# Altium project UU004_UUDMA.PrjPcb
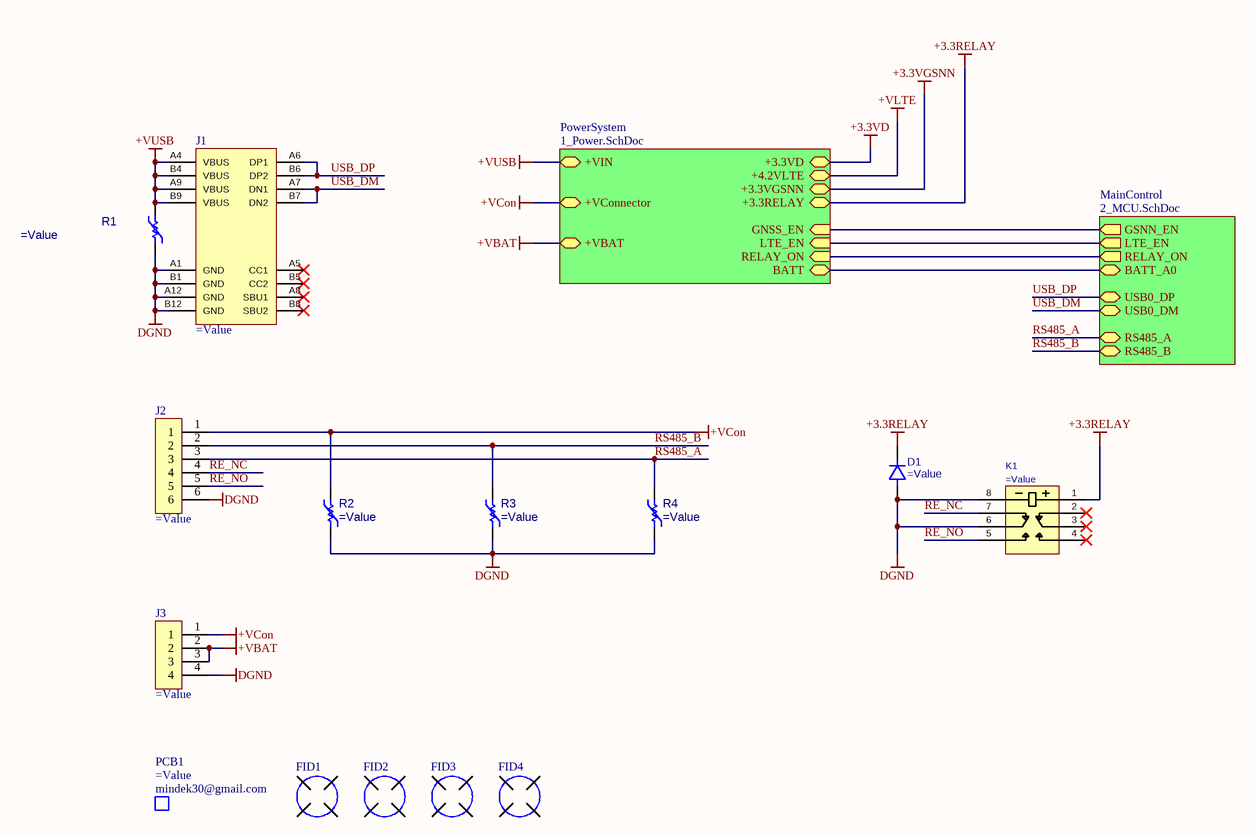
[diagram p0: 0_Overview.SchDoc]
PCB_Name: UUDMA; PCB_PN: UU004; PCB_Rev: A; PCBA_PN: UU004; PCBA_Rev: A
3 sheets, 121 parts. Net scope: hierarchical (ports join the sheet entries above them; power ports are global).
Board file: UU004_UUDMA.PcbDoc
Sheets:
  0_Overview.SchDoc
    MainControl = 2_MCU.SchDoc
    PowerSystem = 1_Power.SchDoc

## Sheet 0_Overview.SchDoc: Overview
size A3; DocumentNumber: 1; SheetNumber: 1; SheetTotal: 6; PageSetup: Record=PageOptions|CenterHorizontal=True|CenterVertical=True|PrintScale=1.01|XCorrection=1.00|YCorrection=1.00|PrintKind=0|BorderSize=5000000|LeftOffset=0|BottomOffset=0|Orientation=2|PaperLength=1000|PaperWidth=1000|Scale=100|PaperSource=7|PrintQuality=-4|MediaType=1|DitherType=10|PaperKind=A3|PrintScaleMode=1

### Parts
D1  (no value)  [SOD323]
FID1  FIDUCIAL  [FID]  (value not drawn)  (no BOM)
FID2  FIDUCIAL  [FID]  (value not drawn)  (no BOM)
FID3  FIDUCIAL  [FID]  (value not drawn)  (no BOM)
FID4  FIDUCIAL  [FID]  (value not drawn)  (no BOM)
J1  (no value)  [GCT_USB4085-GF-A_REVA4]
J2  (no value)  [CON_6P_Header]  (no BOM)
J3  (no value)  [CON_4P_Header]  (no BOM)
K1  (no value)  [RELAY_HFD4/12-SR]
PCB1  Manufacturer: mindek30@gmail.com  (mechanical)
R1  (no value)  [R_0603]
R2  (no value)  [R_0603]
R3  (no value)  [R_0603]
R4  (no value)  [R_0603]

### Sub-sheets
MainControl = 2_MCU.SchDoc: BATT_A0 (bidir), RS485_A (bidir), RS485_B (bidir), USB0_DP (bidir), USB0_DM (bidir), GSNN_EN (out), LTE_EN (out), RELAY_ON (out)
PowerSystem = 1_Power.SchDoc: BATT (bidir), +VIN (bidir), +3.3VD (bidir), GNSS_EN (in), LTE_EN (in), +VConnector (bidir), +4.2VLTE (bidir), +3.3VGSNN (bidir), +3.3RELAY (bidir), RELAY_ON (in), +VBAT (bidir)

### Nets
+3.3RELAY: D1.1 K1.1 ; sheet PowerSystem/+3.3RELAY
+VBAT: J3.2 J3.3 ; sheet PowerSystem/+VBAT
+VCon: J2.1 J3.1 R2.1 ; sheet PowerSystem/+VConnector
+VUSB: J1.A4(VBUS) J1.A9(VBUS) J1.B4(VBUS) J1.B9(VBUS) R1.2 ; sheet PowerSystem/+VIN
DGND: D1.2 J1.A1(GND) J1.A12(GND) J1.B1(GND) J1.B12(GND) J2.6 J3.4 K1.6 K1.8 R1.1 R2.2 R3.1 R4.2
ADC1_IN12: sheet MainControl/BATT_A0, sheet PowerSystem/BATT
LTE_GPSEN: sheet MainControl/GSNN_EN, sheet PowerSystem/GNSS_EN
LTE_PowerON: sheet MainControl/LTE_EN, sheet PowerSystem/LTE_EN
RE_NC: J2.4 K1.7
RE_NO: J2.5 K1.5
RELAY_ON: sheet MainControl/RELAY_ON, sheet PowerSystem/RELAY_ON
RS485_A: J2.3 R4.1 ; sheet MainControl/RS485_A
RS485_B: J2.2 R3.2 ; sheet MainControl/RS485_B
USB_DM: J1.A7(DN1) J1.B7(DN2) ; sheet MainControl/USB0_DM
USB_DP: J1.A6(DP1) J1.B6(DP2) ; sheet MainControl/USB0_DP

Not connected (* = marked no-connect by the designer): J1 A5(CC1)* A8(SBU1)* B5(CC2)* B8(SBU2)*; K1 2* 3* 4*

### Notes on the sheet
- Title :
- Revision :
- ผู้จัดทำ:
- Size:
- A3
- Time:
- ผู้เขียน:
- บริษัท ยูนิเวอร์แซล ยูทีลิตี้ส์ จำกัด (มหาชน) เลขที่ 1 อาคาร อีสท์วอเตอร์ ชั้น 18 ซอยวิภาวดีรังสิต 5 แขวงจอมพล เขตจตุจักร กรุงเทพฯ 10900
  Tel : +662-272-1688
  Fax :+662-2721690-1
- -
- Sheet:
- of
- ผู้อำนวยการ
- ผู้ตรวจสอบ:
- Number:
- กรรมการผู้จัดการ:
- File:

### Library data of the parts
D1 = D_PW_SD103AWS: DIODE SCHOTTKY 40V 2A 0603; Manufacturer: Slkor(SLKORMICRO Elec.); Value: SD103AWS; PackageReference: SOD-323; PartID: C513472; PartNumber: SD103AWS
FID1-FID4 = FID_FIDUCIAL: Manufacturer: mindek30@gmail.com; PartNumber: UU004_A; Value2: Non SE; Value: Non SE; PartID: A; PackageReference: Non SE; Value3: Non SE
J1 = CON_USBC_USB4085: CONN RCPT USB2.0 TYPE C 16+8POS; PartNumber: USB4085-GF-A; Manufacturer: GCT; Value: USB4085-GF-A; PartID: 2073-USB4085-GF-ACT-ND; PackageReference: *; Value2: *; Value3: *
J2 = CON_6P_Heder: Connector 6 position; PartNumber: *; PartID: *; Manufacturer: *; PackageReference: *; Value: *; Value2: *; Value3: *
J3 = CON_4P_Heder: Connector 4 position; PartNumber: *; PartID: *; Manufacturer: *; PackageReference: *; Value: *; Value2: *; Value3: *
K1 = SW_RELAY_HFD4/12-SR: Telecom Non Latching 3VDC DPDT SMD Relays RoHS; Manufacturer: Xiamen Hongfa Electroacoustic; Value: HFD4/3-S1R; PackageReference: *; PartID: C143232; PartNumber: HFD4/3-S1R
PCB1 = PCB_Bare: BARE PCB; PartNumber: UU004_A; PackageReference: Non SE; PartID: A; Value2: =JobFile_Title; Value: =PartNumber; Value3: UU004_A
R1-R4 = R_VAR_VCAC060326C820MRP: VARISTOR 36V 30A 0603; Manufacturer: KYOCERA AVX; Value: VCAC060326C820MRP; PackageReference: 0603; PartID: 478-6255-1-ND; PartNumber: VCAC060326C820MRP

## Sheet 2_MCU.SchDoc
size A3; DocumentNumber: 3; SheetNumber: 3; SheetTotal: 6; PageSetup: Record=PageOptions|CenterHorizontal=True|CenterVertical=True|PrintScale=1.01|XCorrection=1.00|YCorrection=1.00|PrintKind=0|BorderSize=5000000|LeftOffset=0|BottomOffset=0|Orientation=2|PaperLength=1000|PaperWidth=1000|Scale=100|PaperSource=7|PrintQuality=-4|MediaType=1|DitherType=10|PaperKind=A3|PrintScaleMode=1
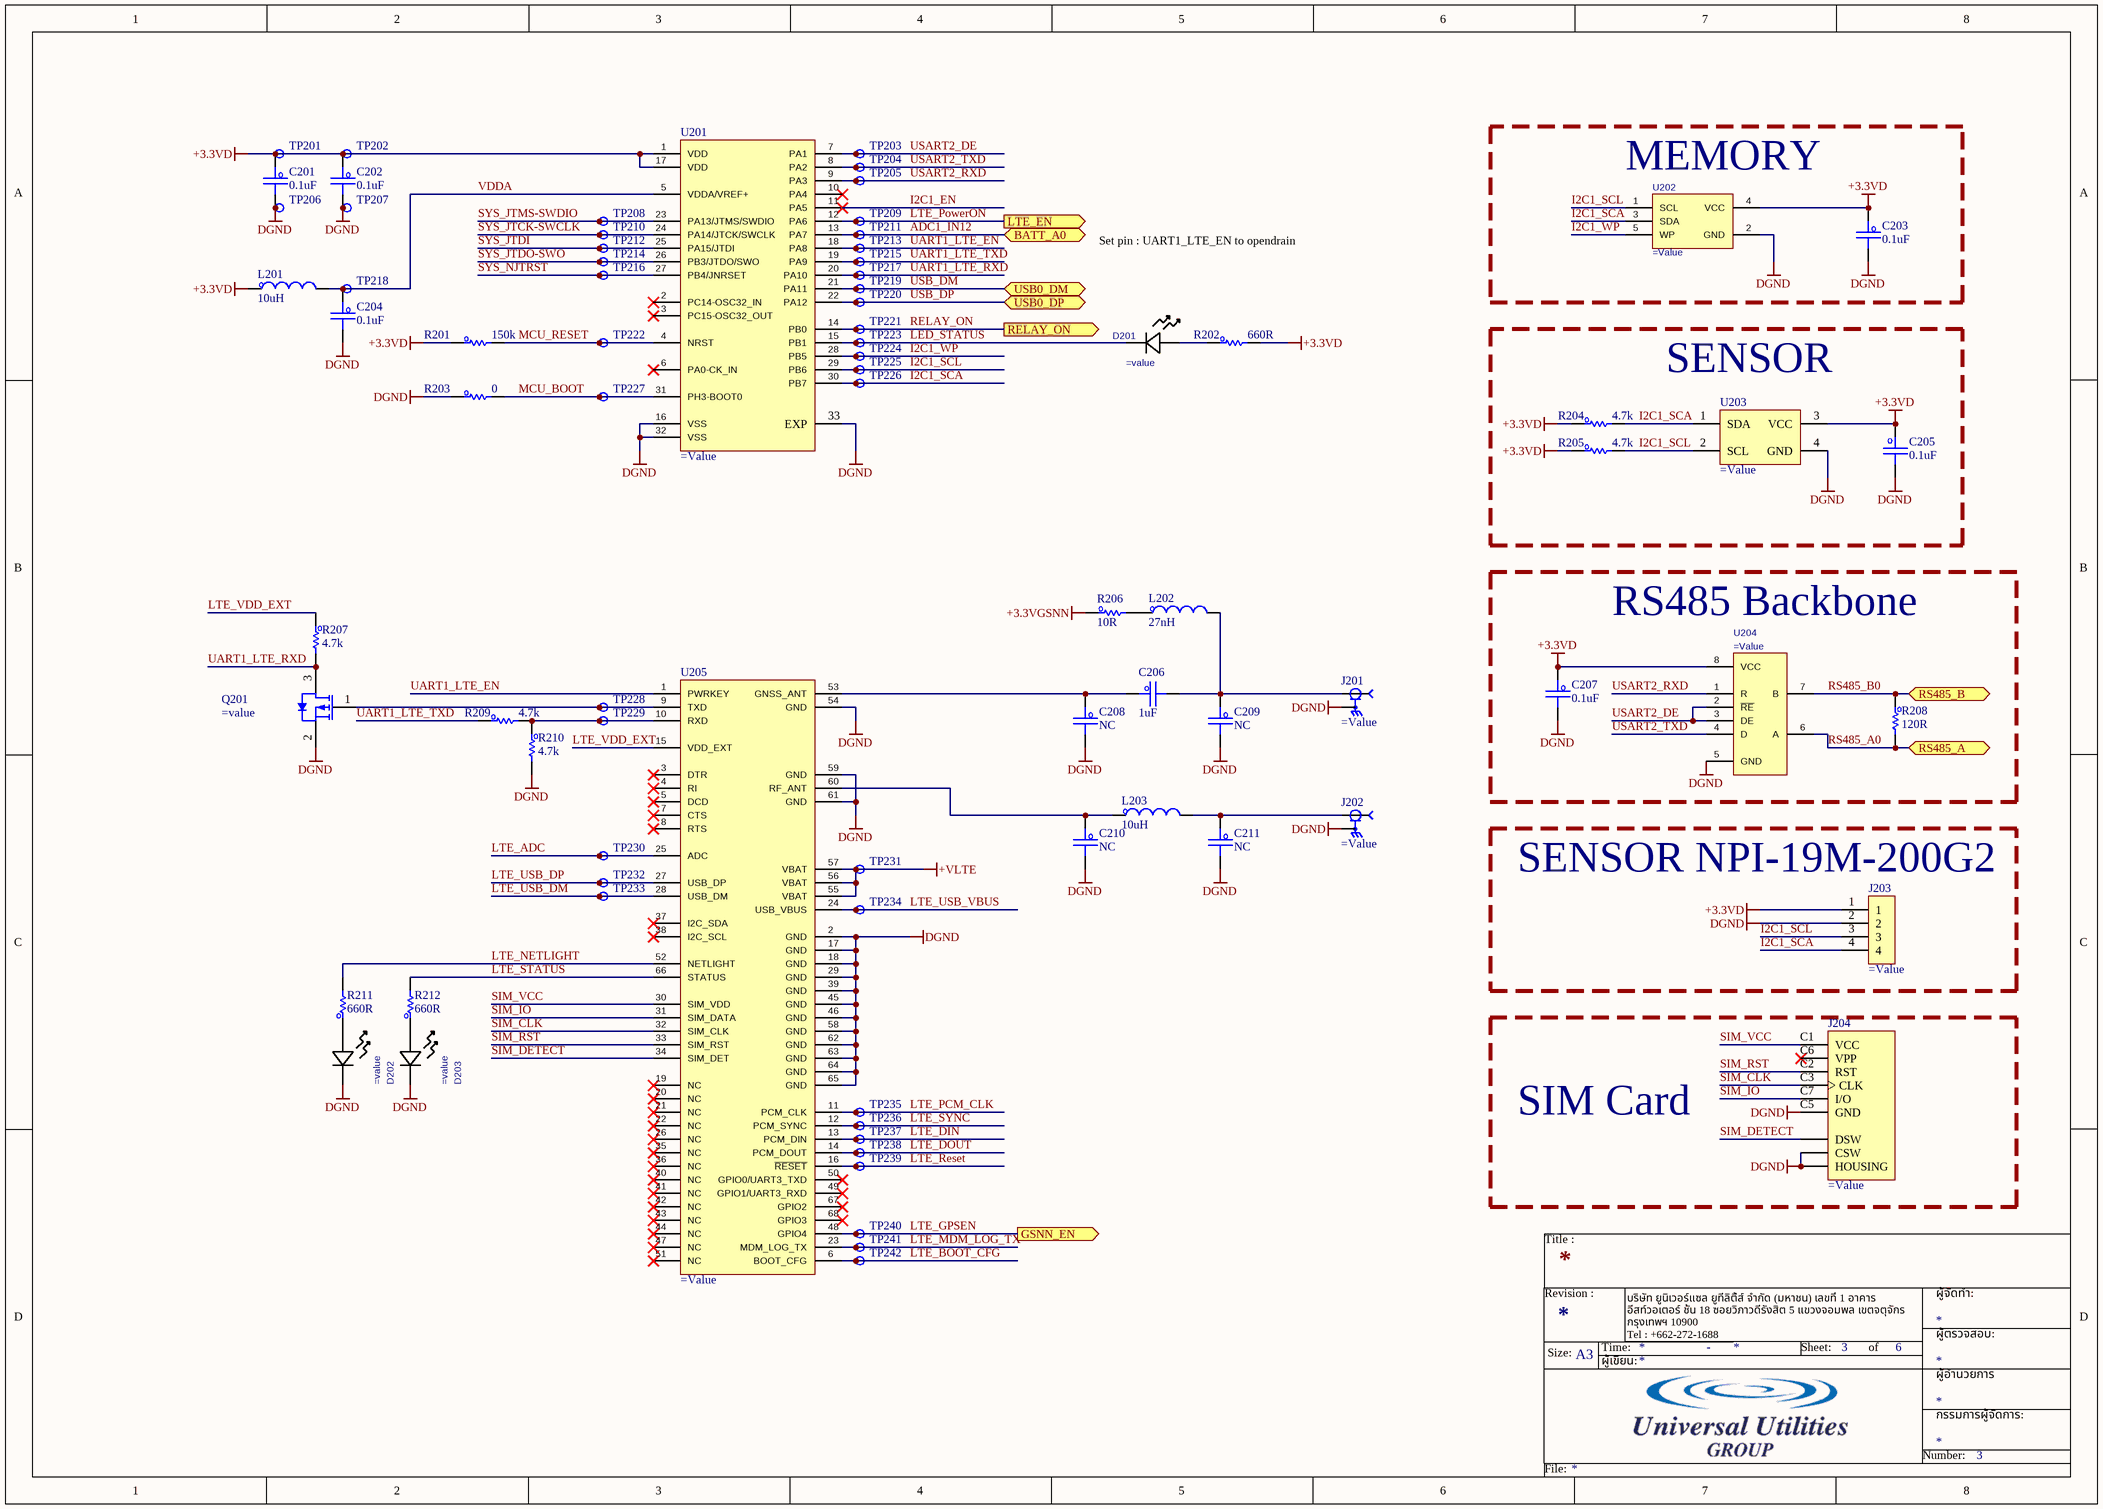
[diagram p1: 2_MCU.SchDoc]

### Parts
C201  0.1uF  [C_0603]
C202  0.1uF  [C_0603]
C203  0.1uF  [C_0603]
C204  0.1uF  [C_0603]
C205  0.1uF  [C_0603]
C206  1uF  [C_0603]
C207  0.1uF  [C_0603]
C208  NC  [C_0603]  (no BOM)
C209  NC  [C_0603]  (no BOM)
C210  NC  [C_0603]  (no BOM)
C211  NC  [C_0603]  (no BOM)
D201  (no value)  [LED_0VS75000_WRE]
D202  (no value)  [LED_0VS75000_WRE]
D203  (no value)  [LED_0VS75000_WRE]
J201  (no value)  [MOLEX_0734120114]
J202  (no value)  [MOLEX_0734120114]
J203  (no value)  [CON_4P_PADSENSOR]  (no BOM)
J204  (no value)  [JAE_SF72S006VBDR2500]
L201  10uH  [L_0603]
L202  27nH  [L_0603]
L203  10uH  [L_0603]
Q201  (no value)  [SOT95P245X110-3M]
R201  150k  [R_0603]
R202  660R  [R_0603]
R203  0  [R_0603]
R204  4.7k  [R_0603]
R205  4.7k  [R_0603]
R206  10R  [R_0603]
R207  4.7k  [R_0603]
R208  120R  [R_0603]
R209  4.7k  [R_0603]
R210  4.7k  [R_0603]
R211  660R  [R_0603]
R212  660R  [R_0603]
TP201  (no value)  [TP_Testpoint]  (no BOM)
TP202  (no value)  [TP_Testpoint]  (no BOM)
TP203  (no value)  [TP_Testpoint]  (no BOM)
TP204  (no value)  [TP_Testpoint]  (no BOM)
TP205  (no value)  [TP_Testpoint]  (no BOM)
TP206  (no value)  [TP_Testpoint]  (no BOM)
TP207  (no value)  [TP_Testpoint]  (no BOM)
TP208  (no value)  [TP_Testpoint]  (no BOM)
TP209  (no value)  [TP_Testpoint]  (no BOM)
TP210  (no value)  [TP_Testpoint]  (no BOM)
TP211  (no value)  [TP_Testpoint]  (no BOM)
TP212  (no value)  [TP_Testpoint]  (no BOM)
TP213  (no value)  [TP_Testpoint]  (no BOM)
TP214  (no value)  [TP_Testpoint]  (no BOM)
TP215  (no value)  [TP_Testpoint]  (no BOM)
TP216  (no value)  [TP_Testpoint]  (no BOM)
TP217  (no value)  [TP_Testpoint]  (no BOM)
TP218  (no value)  [TP_Testpoint]  (no BOM)
TP219  (no value)  [TP_Testpoint]  (no BOM)
TP220  (no value)  [TP_Testpoint]  (no BOM)
TP221  (no value)  [TP_Testpoint]  (no BOM)
TP222  (no value)  [TP_Testpoint]  (no BOM)
TP223  (no value)  [TP_Testpoint]  (no BOM)
TP224  (no value)  [TP_Testpoint]  (no BOM)
TP225  (no value)  [TP_Testpoint]  (no BOM)
TP226  (no value)  [TP_Testpoint]  (no BOM)
TP227  (no value)  [TP_Testpoint]  (no BOM)
TP228  (no value)  [TP_Testpoint]  (no BOM)
TP229  (no value)  [TP_Testpoint]  (no BOM)
TP230  (no value)  [TP_Testpoint]  (no BOM)
TP231  (no value)  [TP_Testpoint]  (no BOM)
TP232  (no value)  [TP_Testpoint]  (no BOM)
TP233  (no value)  [TP_Testpoint]  (no BOM)
TP234  (no value)  [TP_Testpoint]  (no BOM)
TP235  (no value)  [TP_Testpoint]  (no BOM)
TP236  (no value)  [TP_Testpoint]  (no BOM)
TP237  (no value)  [TP_Testpoint]  (no BOM)
TP238  (no value)  [TP_Testpoint]  (no BOM)
TP239  (no value)  [TP_Testpoint]  (no BOM)
TP240  (no value)  [TP_Testpoint]  (no BOM)
TP241  (no value)  [TP_Testpoint]  (no BOM)
TP242  (no value)  [TP_Testpoint]  (no BOM)
U201  (no value)  [QFN50P500X500X60-33N]
U202  (no value)  [SOT95P280X100-5N]
U203  (no value)  [XDCR_SHT40-AD1B-R2]
U204  (no value)  [D0008A_L]
U205  (no value)  [SIM7000A S2-1000]

### Blocks framed on the sheet
MEMORY: C203 U202
SENSOR: C205 R204 R205 U203
RS485 Backbone: C207 R208 U204
SENSOR NPI-19M-200G2: J203
SIM Card: J204

### Ports
BATT_A0 (bidir), GSNN_EN (out), LTE_EN (out), RELAY_ON (out), RS485_A (bidir), RS485_B (bidir), USB0_DM (bidir), USB0_DP (bidir)

### Nets
+3.3VD: C201.1 C202.1 C203.1 C205.1 C207.1 J203.1 L201.1 R201.1 R202.2 R204.1 R205.1 TP201.1 TP202.1 U201.1(VDD) U201.17(VDD) U202.4(VCC) U203.3(VCC) U204.8(VCC)
+3.3VGSNN: R206.1
+VLTE: TP231.1 U205.55(VBAT) U205.56(VBAT) U205.57(VBAT)
DGND: C201.2 C202.2 C203.2 C204.2 C205.2 C207.2 C208.2 C209.2 C210.2 C211.2 D202.2 D203.2 J201.2 J202.2 J203.2 J204.C5(GND) J204.CSW J204.SH(HOUSING) Q201.2(S) R203.1 R210.2 TP206.1 TP207.1 U201.16(VSS) U201.32(VSS) U201.33(EXP) U202.2(GND) U203.4(GND) U204.5(GND) U205.2(GND) U205.17(GND) U205.18(GND) U205.29(GND) U205.39(GND) U205.45(GND) U205.46(GND) U205.54(GND) U205.58(GND) U205.59(GND) U205.61(GND) U205.62(GND) U205.63(GND) U205.64(GND) U205.65(GND)
ADC1_IN12: TP211.1 U201.13(PA7) ; port BATT_A0
I2C1_EN: U201.11(PA5)
I2C1_SCA: J203.4 R204.2 TP226.1 U201.30(PB7) U202.3(SDA) U203.1(SDA)
I2C1_SCL: J203.3 R205.2 TP225.1 U201.29(PB6) U202.1(SCL) U203.2(SCL)
I2C1_WP: TP224.1 U201.28(PB5) U202.5(WP)
LED_STATUS: D201.2 TP223.1 U201.15(PB1)
LTE_ADC: TP230.1 U205.25(ADC)
LTE_BOOT_CFG: TP242.1 U205.6(BOOT_CFG)
LTE_DIN: TP237.1 U205.13(PCM_DIN)
LTE_DOUT: TP238.1 U205.14(PCM_DOUT)
LTE_GPSEN: TP240.1 U205.48(GPIO4) ; port GSNN_EN
LTE_MDM_LOG_TX: TP241.1 U205.23(MDM_LOG_TX)
LTE_NETLIGHT: R211.2 U205.52(NETLIGHT)
LTE_PCM_CLK: TP235.1 U205.11(PCM_CLK)
LTE_PowerON: TP209.1 U201.12(PA6) ; port LTE_EN
LTE_Reset: TP239.1 U205.16(~{RESET})
LTE_STATUS: R212.2 U205.66(STATUS)
LTE_SYNC: TP236.1 U205.12(PCM_SYNC)
LTE_USB_DM: TP233.1 U205.28(USB_DM)
LTE_USB_DP: TP232.1 U205.27(USB_DP)
LTE_USB_VBUS: TP234.1 U205.24(USB_VBUS)
LTE_VDD_EXT: R207.1 U205.15(VDD_EXT)
MCU_BOOT: R203.2 TP227.1 U201.31(PH3-BOOT0)
MCU_RESET: R201.2 TP222.1 U201.4(NRST)
RELAY_ON: TP221.1 U201.14(PB0) ; port RELAY_ON
RS485_A0: R208.2 U204.6(A) ; port RS485_A  [project net RS485_A]
RS485_B0: R208.1 U204.7(B) ; port RS485_B  [project net RS485_B]
SIM_CLK: J204.C3(CLK) U205.32(SIM_CLK)
SIM_DETECT: J204.DSW U205.34(SIM_DET)
SIM_IO: J204.C7(I/O) U205.31(SIM_DATA)
SIM_RST: J204.C2(RST) U205.33(SIM_RST)
SIM_VCC: J204.C1(VCC) U205.30(SIM_VDD)
SYS_JTCK-SWCLK: TP210.1 U201.24(PA14/JTCK/SWCLK)
SYS_JTDI: TP212.1 U201.25(PA15/JTDI)
SYS_JTDO-SWO: TP214.1 U201.26(PB3/JTDO/SWO)
SYS_JTMS-SWDIO: TP208.1 U201.23(PA13/JTMS/SWDIO)
SYS_NJTRST: TP216.1 U201.27(PB4/JNRSET)
UART1_LTE_EN: TP213.1 U201.18(PA8) U205.1(PWRKEY)
UART1_LTE_RXD: Q201.3(D) R207.2 TP217.1 U201.20(PA10)
UART1_LTE_TXD: R209.1 TP215.1 U201.19(PA9)
USART2_DE: TP203.1 U201.7(PA1) U204.2(~{RE}) U204.3(DE)
USART2_RXD: TP205.1 U201.9(PA3) U204.1(R)
USART2_TXD: TP204.1 U201.8(PA2) U204.4(D)
USB_DM: TP219.1 U201.21(PA11) ; port USB0_DM
USB_DP: TP220.1 U201.22(PA12) ; port USB0_DP
VDDA: C204.1 L201.2 TP218.1 U201.5(VDDA/VREF+)
NetC206_1: C206.1 C208.1 U205.53(GNSS_ANT)
NetC206_2: C206.2 C209.1 J201.1 L202.2
NetC210_1: C210.1 L203.1 U205.60(RF_ANT)
NetC211_1: C211.1 J202.1 L203.2
NetD201_1: D201.1 R202.1
NetD202_1: D202.1 R211.1
NetD203_1: D203.1 R212.1
NetL202_1: L202.1 R206.2
NetQ201_1: Q201.1(G) TP228.1 U205.9(TXD)
NetR209_2: R209.2 R210.1 TP229.1 U205.10(RXD)

Not connected (* = marked no-connect by the designer): J204 C6(VPP)*; U201 2(PC14-OSC32_IN)* 3(PC15-OSC32_OUT)* 6(PA0-CK_IN)* 10(PA4)*; U205 3(DTR)* 4(RI)* 5(DCD)* 7(CTS)* 8(RTS)* 19(NC)* 20(NC)* 21(NC)* 22(NC)* 26(NC)* 35(NC)* 36(NC)* 37(I2C_SDA)* 38(I2C_SCL)* 40(NC)* 41(NC)* 42(NC)* 43(NC)* 44(NC)* 47(NC)* 49(GPIO1/UART3_RXD)* 50(GPIO0/UART3_TXD)* 51(NC)* 67(GPIO2)* 68(GPIO3)*

### Notes on the sheet
- Set pin : UART1_LTE_EN to opendrain
- Title :
- Revision :
- ผู้จัดทำ:
- Size:
- A3
- Time:
- ผู้เขียน:
- บริษัท ยูนิเวอร์แซล ยูทีลิตี้ส์ จำกัด (มหาชน) เลขที่ 1 อาคาร อีสท์วอเตอร์ ชั้น 18 ซอยวิภาวดีรังสิต 5 แขวงจอมพล เขตจตุจักร กรุงเทพฯ 10900
  Tel : +662-272-1688
  Fax :+662-2721690-1
- -
- Sheet:
- of
- ผู้อำนวยการ
- ผู้ตรวจสอบ:
- Number:
- กรรมการผู้จัดการ:
- File:

### Library data of the parts
C201-C205 C207 = C_Capacitor: CAP CER 0.1UF 50V X7R 0603; Manufacturer: KEMET; PartNumber: C0603C104K5RACTU; PackageReference: 0603; PartID: 399-5089-1-ND; Value2: 50V; Value: 0.1uF; Value3: *
C206 C208-C211 = C_Capacitor: Capacitor; Manufacturer: *; PackageReference: 0402; PartID: *; PartNumber: *; Value2: *; Value3: *
  C206: Value: 1uF
  C208-C211: Value: NC
D201-D203 = D_LED_150060BS75000: LED BLUE CLEAR 0603 SMD; Manufacturer: Wurth Electronics; Value: 150060VS75000; PackageReference: 0603; PartID: 732-4980-1-ND; PartNumber: 150060VS75000
J201 J202 = CON_U.FL: CONN UMC RCPT STR 50 OHM SMD; PartNumber: 0734120114; Manufacturer: Molex; Value: 0734120114; PartID: WM3894CT-ND; PackageReference: U.FL; Value3: *
J203 = CON_4P_Heder: Connector 4 position; PartNumber: *; PartID: *; Manufacturer: *; PackageReference: *; Value: *; Value2: *; Value3: *
J204 = CON_SIM_NanoSP: NANO SIM CARD CONNECTOR; PartNumber: SF72S006VBDR2500; Manufacturer: JAE Electronics; Value: SF72S006VBDR2500; PartID: 670-2967-1-ND; PackageReference: *; Value2: *; Value3: *
L201-L203 = L_Inductor: 10µH Shielded Multilayer Inductor 250mA 1.05Ohm 0603 (1608 Metric); Manufacturer: TDK Corporation; PartNumber: MLZ1608M100WT000; PackageReference: 0603; PartID: 445-6389-1-ND; Value3: *
  L201 L203: Value: 10uH
  L202: Value: 27nH
Q201 = Q_PMOS_DMP2004K-7: MOSFET P-CH 20V 600MA SOT23-3; Manufacturer: Diodes Incorporated; Value: DMP2004K-7; PackageReference: SOT23-5; PartID: DMP2004KDICT-ND; PartNumber: DMP2004K-7; Value3: *
R201 = R_Resister: RES SMD 150K OHM 1% 1/10W 0603; Manufacturer: Vishay Dale; PartNumber: CRCW0603150KFKEAC; Value2: 0.1W; Value: 150k; PackageReference: 0603; PartID: 541-4034-1-ND; Value3: *
R202 R211 R212 = R_Resister: RES SMD 220 OHM 1% 1/10W 0603; Value: 660R; PackageReference: 0603; Value3: *
R203 = R_Resister: RES SMD 0 OHM JUMP 1/10W 0603; Manufacturer: Vishay Dale; PartNumber: CRCW06030000Z0EBC; Value2: 0.1W; Value: 0; PackageReference: 0603; PartID: 541-4013-1-ND; Value3: *
R204 R205 R207 R209 R210 = R_Resister: RES 4.7K OHM 5% 1/10W 0603; Manufacturer: Vishay Dale; PartNumber: CRCW06034K70JNEBC; Value2: 0.1W; Value: 4.7k; PackageReference: 0603; PartID: 541-CRCW06034K70JNEBCCT-ND; Value3: *
R206 = R_Resister: Resistor; Manufacturer: Vishay; PartNumber: EXB-2HV472JV; Value: 10R; PackageReference: 0603; PartID: *; Value2: *; Value3: *
R208 = R_Resister: RES SMD 120 OHM 1% 1/3W 0603; Manufacturer: Vishay Dale; PartNumber: CRCW0603120RFKEAHP; Value2: 0.333W; Value: 120R; PackageReference: 0603; PartID: 541-120SCT-ND; Value3: *
TP201-TP242 = TP_TestPoint: TestPoint; Manufacturer: *; PackageReference: *; PartID: *; PartNumber: *; Value2: *; Value3: *
U201 = IC_MCU_STM32L432: IC MCU 32BIT 256KB FLSH 32UFQFPN; PartNumber: STM32L432KCU6; Manufacturer: STMicroelectronics; Value: STM32L432KCU6; PartID: 497-16578-ND; PackageReference: *; Value2: *; Value3: *
U202 = IC_MEM_AT24C04D-STUM-T: IC EEPROM 4KBIT I2C 1MHZ SOT23-5; Manufacturer: Microchip Technology; Value: AT24C04D-STUM-T; PackageReference: SOT23-5; PartID: AT24C04D-STUM-TCT-ND; PartNumber: AT24C04D-STUM-T
U203 = IC_SEN_SHT40-AD1B-R3: SENSOR HUMIDITY 100 RH SMD; Manufacturer: Sensirion AG; PartNumber: SHT40-AD1B-R3; PartID: 1649-SHT40-AD1B-R3CT-ND; PackageReference: QFN-4; Value: SHT40-AD1B-R3; Value2: *; Value3: *
U204 = IC_TRAN_THVD1505DR: IC TRANSCEIVER HALF 1/1 8SOIC; Manufacturer: Texas Instruments; PartNumber: SN65HVD11DR; Value: SN65HVD11DR; PackageReference: 8SOIC; PartID: 0086-0766-1; Value3: SN65HVD11DR
U205 = IC_MOD_SIM7000X: DGTL ISO 5000VRMS 6CH 16SOIC; Manufacturer: SIMCom Wireless Solutions Limited; Value: SIM7000G; Value3: 680 bth; PackageReference: QFN-68; PartNumber: SIM7000G

## Sheet 1_Power.SchDoc
size A3; DocumentNumber: 2; SheetNumber: 2; SheetTotal: 6
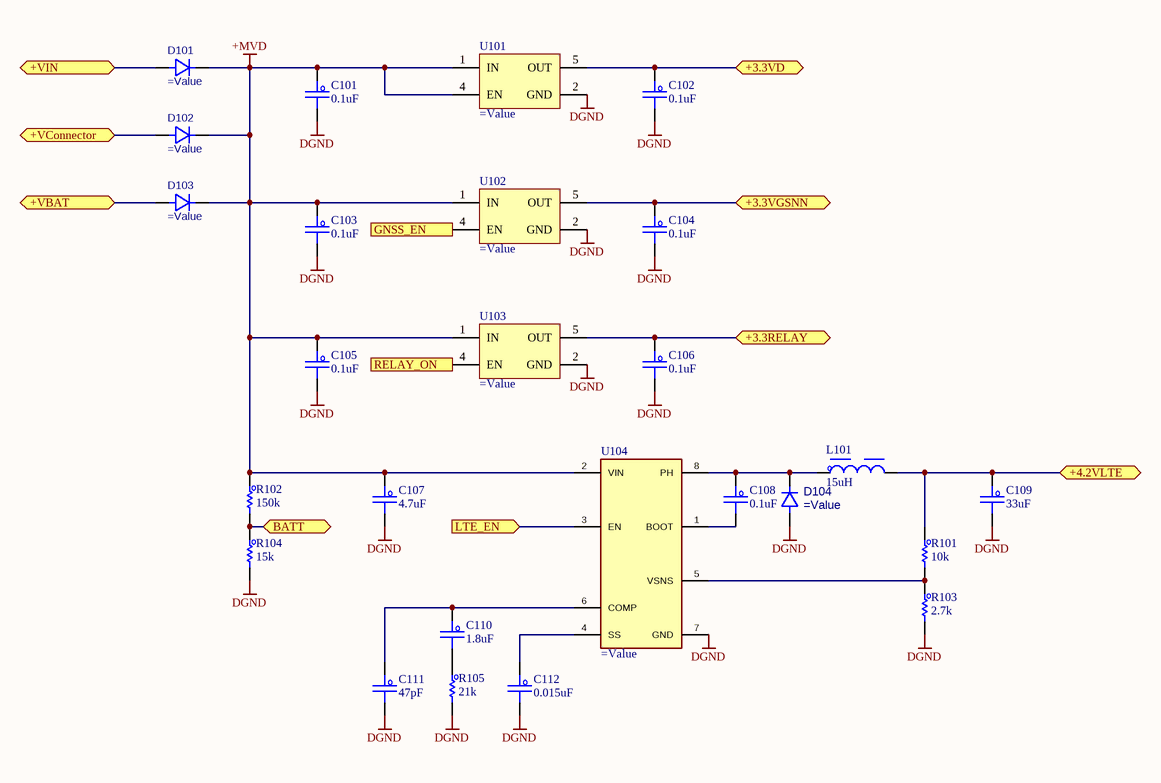
[diagram p2: 1_Power.SchDoc]

### Parts
C101  0.1uF  [C_0603]
C102  0.1uF  [C_0603]
C103  0.1uF  [C_0603]
C104  0.1uF  [C_0603]
C105  0.1uF  [C_0603]
C106  0.1uF  [C_0603]
C107  4.7uF  [C_1206]
C108  0.1uF  [C_0603]
C109  33uF  [C_0805]
C110  1.8uF  [C_0603]
C111  47pF  [C_0603]
C112  0.015uF  [C_0603]
D101  (no value)  [SOD323]
D102  (no value)  [SOD323]  (no BOM)
D103  (no value)  [SOD323]  (no BOM)
D104  (no value)  [DFN119P160X30-2M]
L101  15uH  [IND_04054150_WRE]
R101  10k  [R_0603]
R102  150k  [R_0603]
R103  2.7k  [R_0603]
R104  15k  [R_0603]
R105  21k  [R_0603]
U101  (no value)  [SOT95P280X145-5N]
U102  (no value)  [SOT95P280X145-5N]
U103  (no value)  [SOT95P280X145-5N]
U104  (no value)  [SO-8_STM]

### Ports
+3.3RELAY (bidir), +3.3VD (bidir), +3.3VGSNN (bidir), +4.2VLTE (bidir), +VBAT (bidir), +VConnector (bidir), +VIN (bidir), BATT (bidir), GNSS_EN (in), LTE_EN (in), RELAY_ON (in)

### Nets
+3.3RELAY: C106.1 U103.5(OUT) ; port +3.3RELAY
+3.3VD: C102.1 U101.5(OUT) ; port +3.3VD
+3.3VGSNN: C104.1 U102.5(OUT) ; port +3.3VGSNN
+MVD: C101.1 C103.1 C105.1 C107.1 D101.1 D102.1 D103.1 R102.1 U101.1(IN) U101.4(EN) U102.1(IN) U103.1(IN) U104.2(VIN)
+VBAT: D103.2 ; port +VBAT
+VCon: D102.2 ; port +VConnector
+VLTE: C109.1 L101.2 R101.1 ; port +4.2VLTE
+VUSB: D101.2 ; port +VIN
DGND: C101.2 C102.2 C103.2 C104.2 C105.2 C106.2 C107.2 C109.2 C111.2 C112.2 D104.2 R103.2 R104.2 R105.2 U101.2(GND) U102.2(GND) U103.2(GND) U104.7(GND)
ADC1_IN12: R102.2 R104.1 ; port BATT
LTE_GPSEN: U102.4(EN) ; port GNSS_EN
LTE_PowerON: U104.3(EN) ; port LTE_EN
RELAY_ON: U103.4(EN) ; port RELAY_ON
NetC108_1: C108.1 D104.1 L101.1 U104.8(PH)
NetC108_2: C108.2 U104.1(BOOT)
NetC110_1: C110.1 C111.1 U104.6(COMP)
NetC110_2: C110.2 R105.1
NetC112_1: C112.1 U104.4(SS)
NetR101_2: R101.2 R103.1 U104.5(VSNS)

### Notes on the sheet
- Title :
- Revision :
- ผู้จัดทำ:
- Size:
- A3
- Time:
- ผู้เขียน:
- บริษัท ยูนิเวอร์แซล ยูทีลิตี้ส์ จำกัด (มหาชน) เลขที่ 1 อาคาร อีสท์วอเตอร์ ชั้น 18 ซอยวิภาวดีรังสิต 5 แขวงจอมพล เขตจตุจักร กรุงเทพฯ 10900
  Tel : +662-272-1688
  Fax :+662-2721690-1
- -
- Sheet:
- of
- ผู้อำนวยการ
- ผู้ตรวจสอบ:
- Number:
- กรรมการผู้จัดการ:
- File:

### Library data of the parts
C101-C106 C108 = C_Capacitor: as C201 on sheet 2_MCU; PackageReference: 0603; PartID: 399-5089-1-ND; Value2: 50V; Value: 0.1uF; Value3: *
C107 = C_Capacitor: CAP CER 4.7UF 50V X7R 1206; Manufacturer: KEMET; PartNumber: C1206C475K5RAC7800; PackageReference: 1206; PartID: 399-C1206C475K5RAC7800CT-ND; Value2: 50V; Value: 4.7uF; Value3: *
C109 = C_Capacitor: CAP CER 33UF 10V X5R 0805; Manufacturer: TDK Corporation; PartNumber: C2012X5R1A336M125AC; PackageReference: 0805; PartID: 445-8238-1-ND; Value2: 10V; Value: 33uF; Value3: *
C110 = C_Capacitor: CAP CER 1800PF 50V X7R 0603; Manufacturer: KEMET; PartNumber: C0603C182K5RAC7867; Value2: 10V; PackageReference: 0603; PartID: 399-C0603C182K5RAC7867CT-ND; Value: 1.8uF; Value3: *
C111 = C_Capacitor: CAP CER 47PF 50V X7R 0603; Manufacturer: KEMET; PartNumber: C0603C470J5RAC7867; PackageReference: 0603; PartID: 399-C0603C470J5RAC7867CT-ND; Value2: 50V; Value: 47pF; Value3: *
C112 = C_Capacitor: CAP CER 15PF 50V C0G/NP0 0603; Manufacturer: KEMET; PartNumber: C0603C150J5GAC7867; Value2: 10V; PackageReference: 0603; PartID: 399-C0603C150J5GAC7867CT-ND; Value: 0.015uF; Value3: *
D101-D103 = D_PW_SD103AWS: as D1 on sheet 0_Overview; Value: SD103AWS; PackageReference: SOD-323; PartID: C513472; PartNumber: SD103AWS
D104 = D_PW_VSKY20301608: DIODE SCHOTTKY 30V 2A 0603; Manufacturer: Vishay General Semiconductor - Diodes Division; Value: VSKY20301608-G4-08; PackageReference: 0603; PartID: 112-VSKY20301608-G4-08CT-ND; PartNumber: VSKY20301608-G4-08
L101 = L_74404054150: FIXED IND 15UH 2A 86 MOHM SMD; Manufacturer: Würth Elektronik; Value: 15uH; PackageReference: 0603; PartID: 732-5521-1-ND; PartNumber: 74404054150; Value3: *
R101 = R_Resister: RES 10K OHM 5% 1/10W 0603; Manufacturer: Vishay Dale; PartNumber: CRCW060310K0JNEBC; Value2: 0.1W; Value: 10k; PackageReference: 0603; PartID: 541-CRCW060310K0JNEBCCT-ND; Value3: *
R102 = R_Resister: as R201 on sheet 2_MCU; Value: 150k; PackageReference: 0603; PartID: 541-4034-1-ND; Value3: *
R103 = R_Resister: RES 2.7K OHM 5% 1/10W 0603; Manufacturer: Vishay Dale; PartNumber: CRCW06032K70JNEAC; Value2: 0.1W; Value: 2.7k; PackageReference: 0603; PartID: 541-CRCW06032K70JNEACCT-ND; Value3: *
R104 = R_Resister: RES 15K OHM 5% 1/10W 0603; Manufacturer: Vishay Dale; PartNumber: CRCW060315K0JNEAC; Value2: 0.1W; Value: 15k; PackageReference: 0603; PartID: 541-CRCW060315K0JNEACCT-ND; Value3: *
R105 = R_Resister: RES SMD 150K OHM 1% 1/10W 0603; Value2: 0.1W; Value: 21k; PackageReference: 0603; Value3: *
U101-U103 = IC_LDO_RT9069-33GB: 200mA 360mV@(10mA) Fixed 3.3V~3.3V Positive 1 36V SOT-23-5 Linear Voltage Regulators (LDO) ROHS; Manufacturer: Richtek Tech; PartNumber: RT9069-33GB; PartID: C147969; PackageReference: SOT-23-5; Value: RT9069-33GB; Value2: *; Value3: *
U104 = IC_PMS_TPS54231DR: IC REG BUCK ADJUSTABLE 2A 8SOIC; Manufacturer: Texas Instruments; PartNumber: TPS54231DR; PartID: 595-TPS54231DR; PackageReference: 8-SOIC; Value: TPS54231DR; Value2: *; Value3: *

## Nets that join several sheets
+3.3RELAY: 0_Overview (D1.1 K1.1), 1_Power (C106.1 U103.5)
+3.3VD: 2_MCU (18 pins), 1_Power (C102.1 U101.5)
+3.3VGSNN: 2_MCU (R206.1), 1_Power (C104.1 U102.5)
+VBAT: 0_Overview (J3.2 J3.3), 1_Power (D103.2)
+VCon: 0_Overview (J2.1 J3.1 R2.1), 1_Power (D102.2)
+VLTE: 2_MCU (TP231.1 U205.55 U205.56 U205.57), 1_Power (C109.1 L101.2 R101.1)
+VUSB: 0_Overview (5 pins), 1_Power (D101.2)
DGND: 0_Overview (13 pins), 2_MCU (44 pins), 1_Power (18 pins)
ADC1_IN12: 2_MCU (TP211.1 U201.13), 1_Power (R102.2 R104.1)
LTE_GPSEN: 2_MCU (TP240.1 U205.48), 1_Power (U102.4)
LTE_PowerON: 2_MCU (TP209.1 U201.12), 1_Power (U104.3)
RELAY_ON: 2_MCU (TP221.1 U201.14), 1_Power (U103.4)
RS485_A: 0_Overview (J2.3 R4.1), 2_MCU (R208.2 U204.6)
RS485_B: 0_Overview (J2.2 R3.2), 2_MCU (R208.1 U204.7)
USB_DM: 0_Overview (J1.A7 J1.B7), 2_MCU (TP219.1 U201.21)
USB_DP: 0_Overview (J1.A6 J1.B6), 2_MCU (TP220.1 U201.22)